# Altium project BMRS_PCB.003.01.PUMA_Interface_Controler.PrjPcb
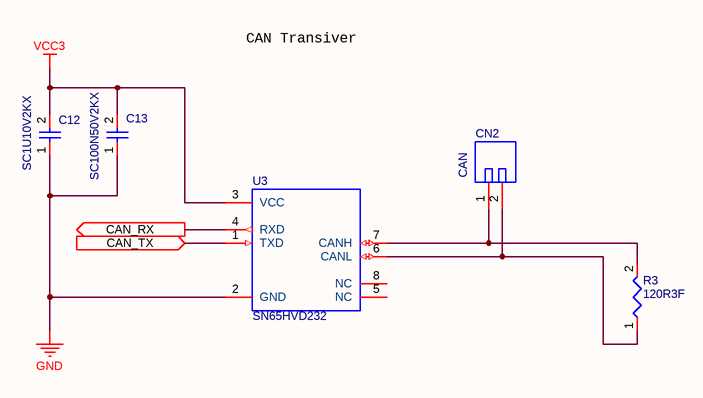
[diagram p0: 3_CAN.SchDoc]
3 sheets, 13 parts. Net scope: flat (ports and power ports of the same name join across sheets).
Board file: PM-1_InterfaceControler.PcbDoc
Sheets:
  3_CAN.SchDoc
  4_USB.SchDoc
  2_Power.SchDoc

## Sheet 3_CAN.SchDoc: Title
size 420 x 297 mm; Address1: Address1; Address2: Address2; Address3: Address3; Address4: Address4; SheetNumber: 1; Scale: 1:1; Title2str: Title2str; DocumentType: Схема электрическая принципиальная

### Parts
C12  SC1U10V2KX  [CAPC0402(1005)60_L]
C13  SC100N50V2KX  [CAPC0402(1005)60_L]
CN2  CAN  [2PHEADERS-2D54]
R3  120R3F  [RESC0603(1608)_L]
U3  SN65HVD232  [SOIC127P600X175-8L]

### Ports
CAN_RX (out), CAN_TX (in)

### Nets
GND: C12.1 C13.1 U3.2(GND)
VCC3: C12.2 C13.2 U3.3(VCC)
CAN_RX: U3.4(RXD) ; port CAN_RX
CAN_TX: U3.1(TXD) ; port CAN_TX
NetCN2_1: CN2.1 R3.2 U3.7(CANH)
NetCN2_2: CN2.2 R3.1 U3.6(CANL)

Not connected (* = marked no-connect by the designer): U3 5(NC) 8(NC)

### Notes on the sheet
- CAN Transiver
- Перв. примен.
- Справ. №
- Подп. и дата
- Инв. № дубл.
- Взам. инв. №
- Разраб.
- Изм.
- Лист
- № докум.
- Подп.
- Дата
- Лит.
- Масса
- Масштаб
- Пров.
- Т.контр.
- Листов
- Инв. № подл.
- Утв.
- Н.контр.
- 2.106-A3
- Копировал
- Формат А3

### Library data of the parts
C12 = CAP(0402)1UF10V: CAP 1uF 10V ±10% 0402 (1005 Metric) Thickness 0.6mm SMD
C13 = CAP(0402)100nF50V: CAP 100nF 50V ±10% 0402 (1005 Metric) Thickness 0.6mm SMD
CN2 = 2PIN-CN: 2 holes for 18awg wire; Manufacturer: JST; Datasheet URL: http://www.jst-mfg.com/product/pdf/eng/eGH.pdf; Package Reference: JST-BM04B-GHS-TBT
R3 = RES0(0603)_120R: 120R 0.1W 1% 0603 (1608 Metric)  SMD
U3 = CAN_SN65HVD232D: IC CAN TRANSCEIVER 8-SOIC

## Sheet 4_USB.SchDoc: Title
size 420 x 297 mm; Address1: Address1; Address2: Address2; Address3: Address3; Address4: Address4; SheetNumber: 1; Scale: 1:1; Title2str: Title2str; DocumentType: Схема электрическая принципиальная
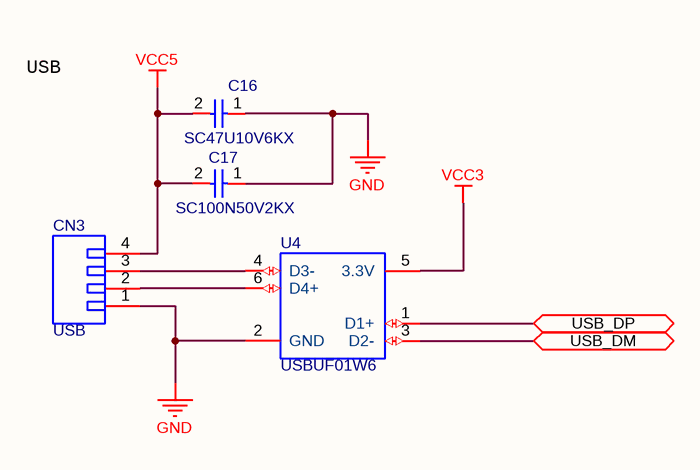
[diagram p1: 4_USB.SchDoc]

### Parts
C16  SC47U10V6KX  [CAPC1206(3216)]
C17  SC100N50V2KX  [CAPC0402(1005)60_L]
CN3  USB  [4PHEADERS-2D54]
U4  USBUF01W6  [SOT323-6L]

### Ports
USB_DM (bidir), USB_DP (bidir)

### Nets
GND: C16.1 C17.1 CN3.1 U4.2(GND)
VCC3: U4.5(3.3V)
VCC5: C16.2 C17.2 CN3.4
USB_DM: U4.3(D2-) ; port USB_DM
USB_DP: U4.1(D1+) ; port USB_DP
NetCN3_2: CN3.2 U4.6(D4+)
NetCN3_3: CN3.3 U4.4(D3-)

### Notes on the sheet
- USB
- Перв. примен.
- Справ. №
- Подп. и дата
- Инв. № дубл.
- Взам. инв. №
- Разраб.
- Изм.
- Лист
- № докум.
- Подп.
- Дата
- Лит.
- Масса
- Масштаб
- Пров.
- Т.контр.
- Листов
- Инв. № подл.
- Утв.
- Н.контр.
- 2.106-A3
- Копировал
- Формат А3

### Library data of the parts
C16 = CAP(1206)47UF10V: CAP 47uF 10V ±10% 1206(3216 Metric) Thickness 1.8mm SMD
C17 = CAP(0402)100nF50V: as C13 on sheet 3_CAN
CN3 = 4PIN-CN: 4 holes for 18awg wire; Manufacturer: JST; Datasheet URL: http://www.jst-mfg.com/product/pdf/eng/eGH.pdf; Package Reference: JST-BM04B-GHS-TBT

## Sheet 2_Power.SchDoc: Title
size 420 x 297 mm; Address1: Address1; Address2: Address2; Address3: Address3; Address4: Address4; SheetNumber: 1; Scale: 1:1; Title2str: Title2str; DocumentType: Схема электрическая принципиальная
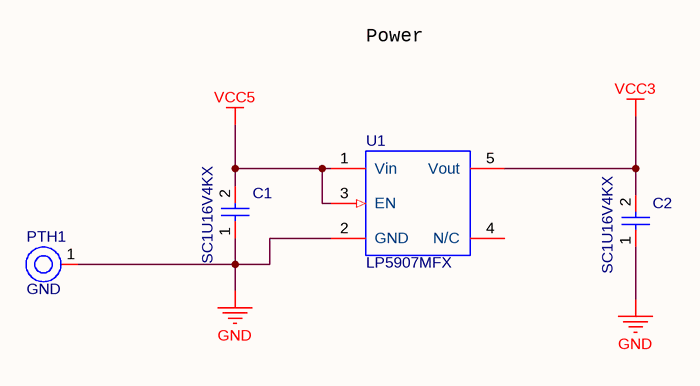
[diagram p2: 2_Power.SchDoc]

### Parts
C1  SC1U16V4KX  [CAPC0805(2012)145_L]
C2  SC1U16V4KX  [CAPC0805(2012)145_L]
PTH1  GND  [POWERHOLE-LP]  (no BOM)
U1  LP5907MFX  [SOT95P280X145-5L]

### Nets
GND: C1.1 C2.1 PTH1.1(H1) U1.2(GND)
VCC3: C2.2 U1.5(Vout)
VCC5: C1.2 U1.1(Vin) U1.3(EN)

Not connected (* = marked no-connect by the designer): U1 4(N/C)

### Notes on the sheet
- Power
- Перв. примен.
- Справ. №
- Подп. и дата
- Инв. № дубл.
- Взам. инв. №
- Разраб.
- Изм.
- Лист
- № докум.
- Подп.
- Дата
- Лит.
- Масса
- Масштаб
- Пров.
- Т.контр.
- Листов
- Инв. № подл.
- Утв.
- Н.контр.
- 2.106-A3
- Копировал
- Формат А3

### Library data of the parts
C1 C2 = CAP(0805)1UF16V: CAP 1uF 16V ±10% 0805(1610 Metric) Thickness 0.6mm SMD
PTH1 = PTH-1D2M: 1.2mm hole 2mm pad; Pad diameter (mm): 5; Hole diameter (mm): 2.5
U1 = LP5907V3.3: 3.3V 250mA

## Nets that join several sheets
GND: 3_CAN (C12.1 C13.1 U3.2), 4_USB (C16.1 C17.1 CN3.1 U4.2), 2_Power (C1.1 C2.1 PTH1.1 U1.2)
VCC3: 3_CAN (C12.2 C13.2 U3.3), 4_USB (U4.5), 2_Power (C2.2 U1.5)
VCC5: 4_USB (C16.2 C17.2 CN3.4), 2_Power (C1.2 U1.1 U1.3)